# Altium schematic sheet 16 HDMI.SchDoc
size 420 x 297 mm; Address1: Address1; Address2: Address2; Address3: Address3; Address4: Address4; DocumentNumber: АБВГ.123456.001 Э3; SheetNumber: 16; SheetTotal: 23; Scale: 1:1; DocumentType: Схема электрическая принципиальная; FirstReferrence: АБВГ.123456.001
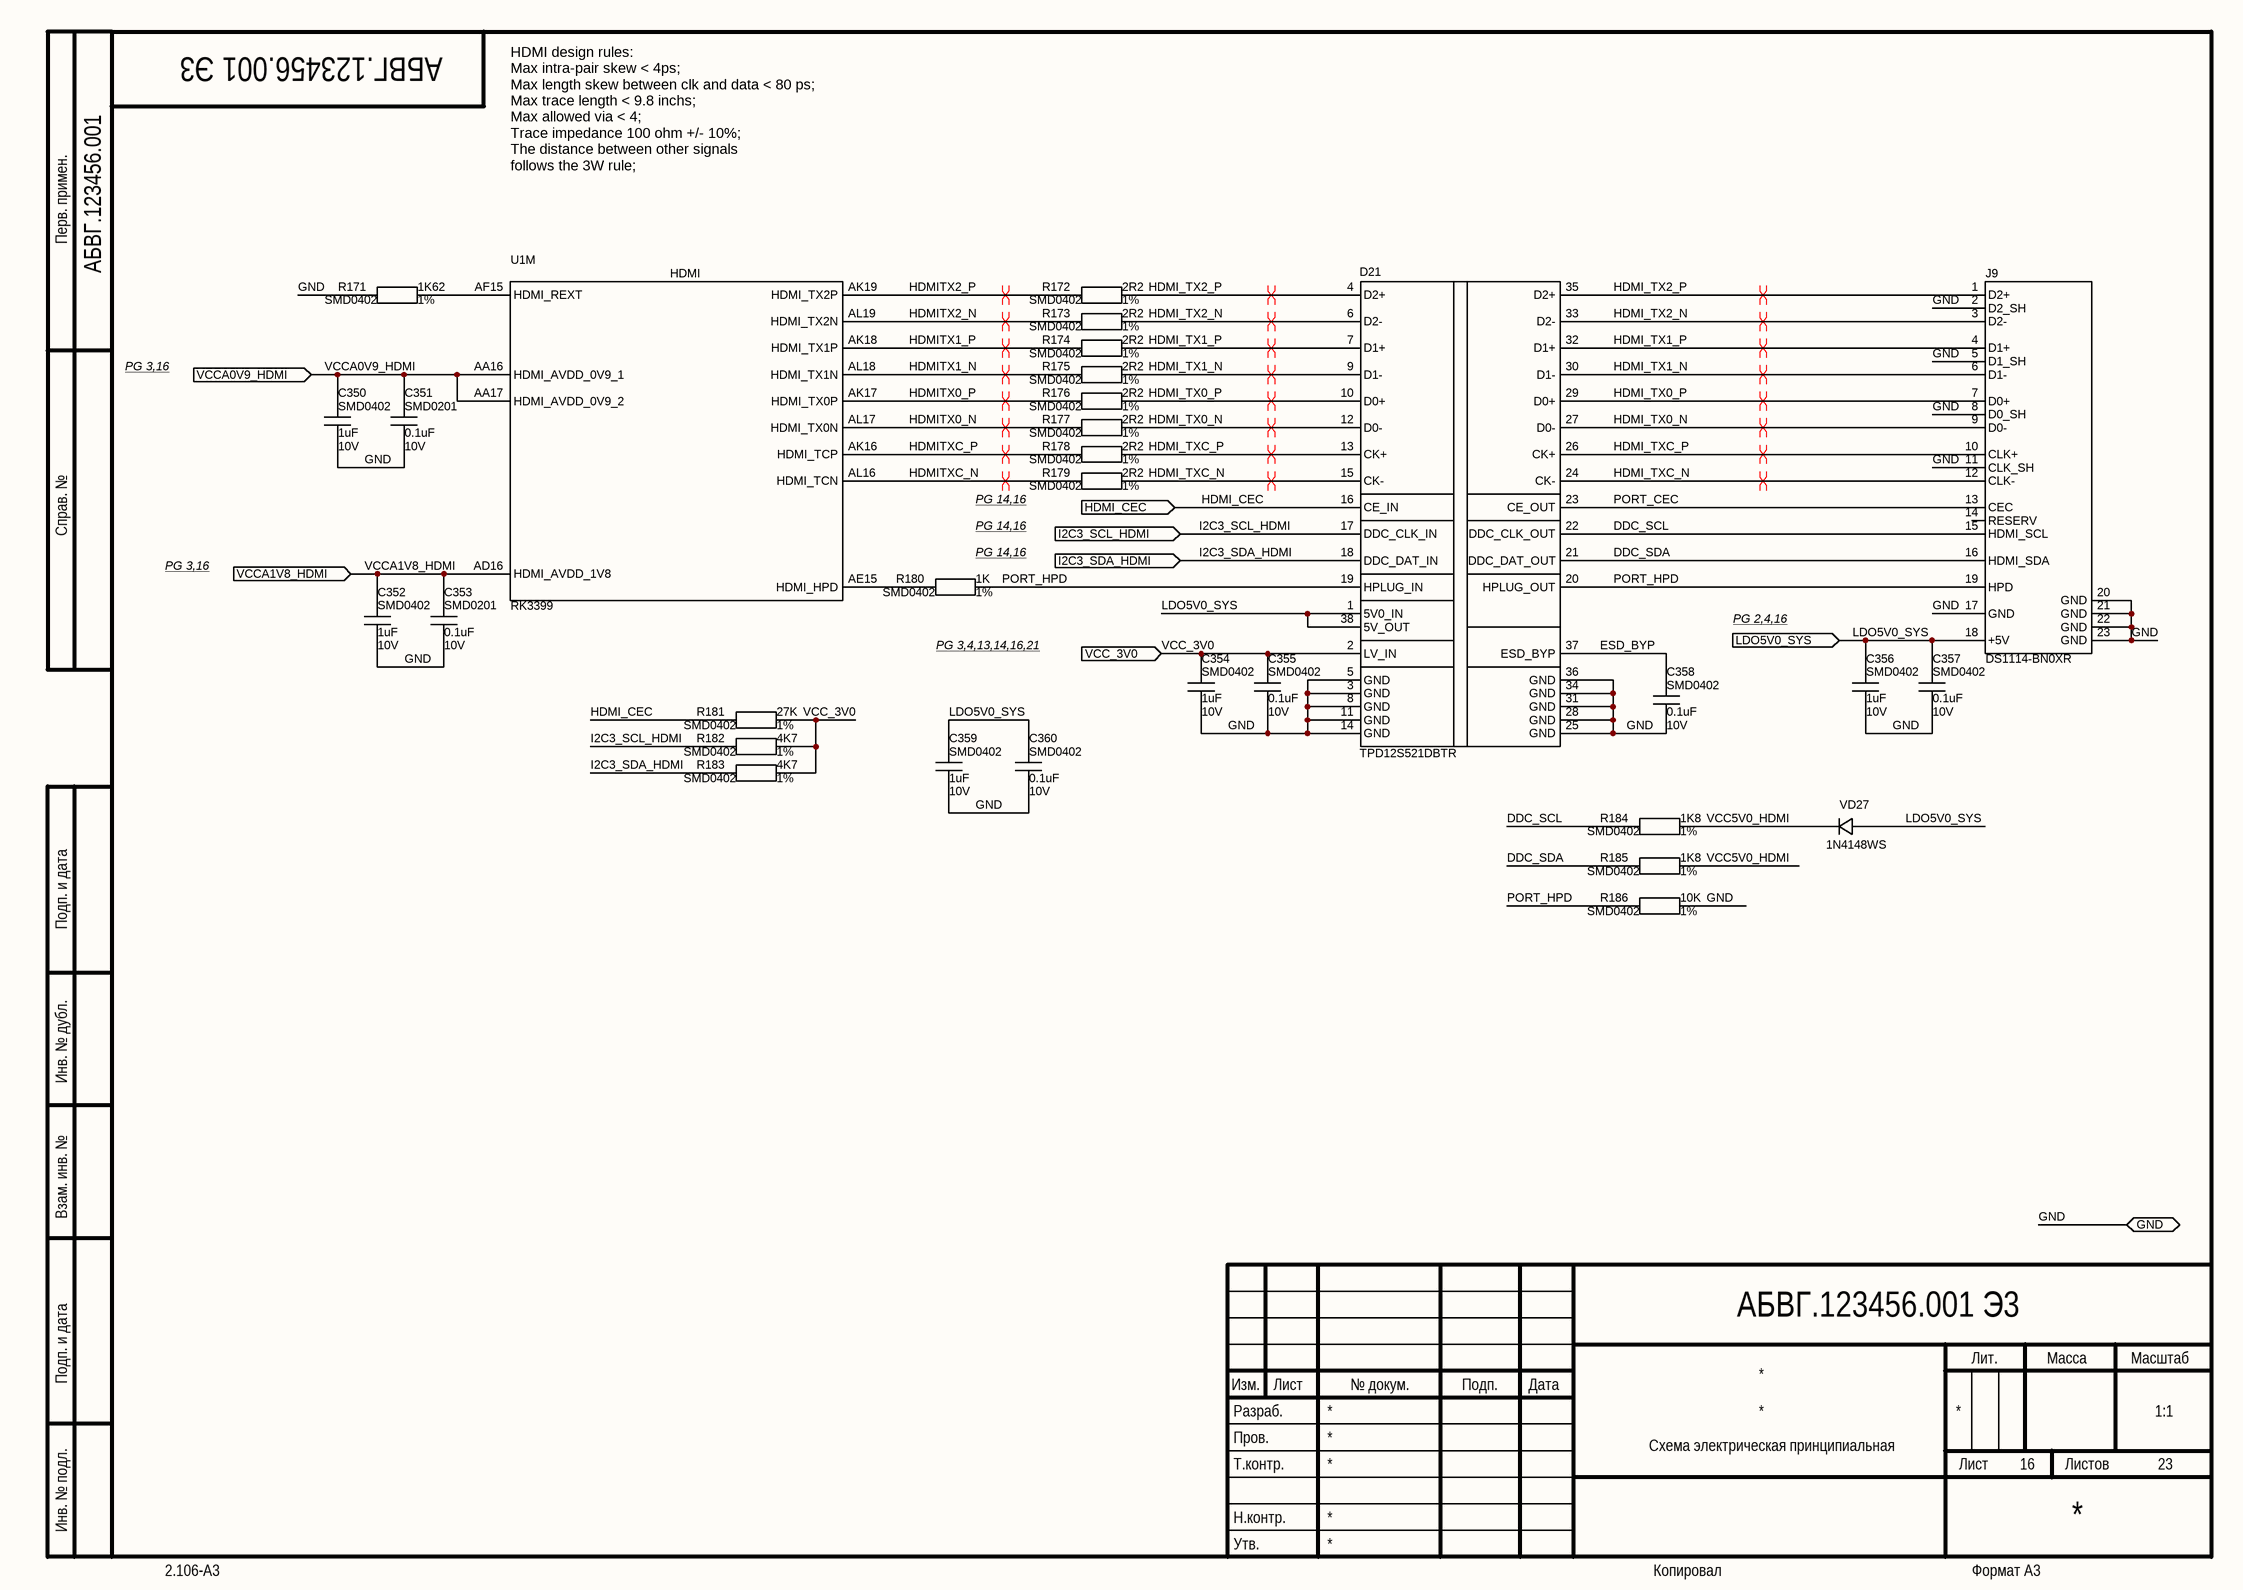
[diagram p0: 16 HDMI.SchDoc]

## Parts
C350  Package: SMD0402  Voltage: 10V  [CAP_SMD_0402]  (hidden comment: 1uF)
C351  Package: SMD0201  Voltage: 10V  [CAP_SMD_0201]  (hidden comment: 0.1uF)
C352  Package: SMD0402  Voltage: 10V  [CAP_SMD_0402_small]  (hidden comment: 1uF)
C353  Package: SMD0201  Voltage: 10V  [CAP_SMD_0201]  (hidden comment: 0.1uF)
C354  Package: SMD0402  Voltage: 10V  [CAP_SMD_0402]  (hidden comment: 1uF)
C355  Package: SMD0402  Voltage: 10V  [CAP_SMD_0402]  (hidden comment: 0.1uF)
C356  Package: SMD0402  Voltage: 10V  [CAP_SMD_0402]  (hidden comment: 1uF)
C357  Package: SMD0402  Voltage: 10V  [CAP_SMD_0402]  (hidden comment: 0.1uF)
C358  Package: SMD0402  Voltage: 10V  [CAP_SMD_0402]  (hidden comment: 0.1uF)
C359  Package: SMD0402  Voltage: 10V  [CAP_SMD_0402]  (hidden comment: 1uF)
C360  Package: SMD0402  Voltage: 10V  [CAP_SMD_0402]  (hidden comment: 0.1uF)
D21  TPD12S521DBTR  [TSSOP-38]
J9  DS1114-BN0XR  [DS1114-BN0XR]
R171  Package: SMD0402  Tolerance: 1%  [RES_SMD_0402_SMALL]  (hidden comment: 1K62)
R172  Package: SMD0402  Tolerance: 1%  [RES_SMD_0402]  (hidden comment: 2R2)
R173  Package: SMD0402  Tolerance: 1%  [RES_SMD_0402]  (hidden comment: 2R2)
R174  Package: SMD0402  Tolerance: 1%  [RES_SMD_0402]  (hidden comment: 2R2)
R175  Package: SMD0402  Tolerance: 1%  [RES_SMD_0402]  (hidden comment: 2R2)
R176  Package: SMD0402  Tolerance: 1%  [RES_SMD_0402]  (hidden comment: 2R2)
R177  Package: SMD0402  Tolerance: 1%  [RES_SMD_0402]  (hidden comment: 2R2)
R178  Package: SMD0402  Tolerance: 1%  [RES_SMD_0402]  (hidden comment: 2R2)
R179  Package: SMD0402  Tolerance: 1%  [RES_SMD_0402]  (hidden comment: 2R2)
R180  Package: SMD0402  Tolerance: 1%  [RES_SMD_0402]  (hidden comment: 1K)
R181  Package: SMD0402  Tolerance: 1%  [RES_SMD_0402]  (hidden comment: 27K)
R182  Package: SMD0402  Tolerance: 1%  [RES_SMD_0402]  (hidden comment: 4K7)
R183  Package: SMD0402  Tolerance: 1%  [RES_SMD_0402]  (hidden comment: 4K7)
R184  Package: SMD0402  Tolerance: 1%  [RES_SMD_0402]  (hidden comment: 1K8)
R185  Package: SMD0402  Tolerance: 1%  [RES_SMD_0402]  (hidden comment: 1K8)
R186  Package: SMD0402  Tolerance: 1%  [RES_SMD_0402]  (hidden comment: 10K)
U1  value RK3399  [BGA828C65P31X31_2100X2100X161N]  (hidden comment: RK3399_FF)  (part M of 23)
VD27  value 1N4148WS  [SOD323]  (hidden comment: Diode)

## Ports
GND (bidir), HDMI_CEC (in), I2C3_SCL_HDMI (in), I2C3_SDA_HDMI (in), LDO5V0_SYS (in), VCC_3V0 (in), VCCA0V9_HDMI (in), VCCA1V8_HDMI (in)

## Nets
DDC_SCL: D21.22(DDC_CLK_OUT) J9.15(HDMI_SCL) R184.1
DDC_SDA: D21.21(DDC_DAT_OUT) J9.16(HDMI_SDA) R185.1
ESD_BYP: C358.1 D21.37(ESD_BYP)
GND: C350.2 C351.2 C352.2 C353.2 C354.2 C355.2 C356.2 C357.2 C358.2 C359.2 C360.2 D21.3(GND) D21.5(GND) D21.8(GND) D21.11(GND) D21.14(GND) D21.25(GND) D21.28(GND) D21.31(GND) D21.34(GND) D21.36(GND) J9.2(D2_SH) J9.5(D1_SH) J9.8(D0_SH) J9.11(CLK_SH) J9.17(GND) J9.20(GND) J9.21(GND) J9.22(GND) J9.23(GND) R171.1 R186.1 ; port GND
HDMI_CEC: D21.16(CE_IN) R181.1 ; port HDMI_CEC
HDMI_TX0_N: D21.12(D0-) D21.27(D0-) J9.9(D0-) R177.2
HDMI_TX0_P: D21.10(D0+) D21.29(D0+) J9.7(D0+) R176.2
HDMI_TX1_N: D21.9(D1-) D21.30(D1-) J9.6(D1-) R175.2
HDMI_TX1_P: D21.7(D1+) D21.32(D1+) J9.4(D1+) R174.2
HDMI_TX2_N: D21.6(D2-) D21.33(D2-) J9.3(D2-) R173.2
HDMI_TX2_P: D21.4(D2+) D21.35(D2+) J9.1(D2+) R172.2
HDMI_TXC_N: D21.15(CK-) D21.24(CK-) J9.12(CLK-) R179.2
HDMI_TXC_P: D21.13(CK+) D21.26(CK+) J9.10(CLK+) R178.2
HDMITX0_N: R177.1 U1.AL17(HDMI_TX0N)
HDMITX0_P: R176.1 U1.AK17(HDMI_TX0P)
HDMITX1_N: R175.1 U1.AL18(HDMI_TX1N)
HDMITX1_P: R174.1 U1.AK18(HDMI_TX1P)
HDMITX2_N: R173.1 U1.AL19(HDMI_TX2N)
HDMITX2_P: R172.1 U1.AK19(HDMI_TX2P)
HDMITXC_N: R179.1 U1.AL16(HDMI_TCN)
HDMITXC_P: R178.1 U1.AK16(HDMI_TCP)
I2C3_SCL_HDMI: D21.17(DDC_CLK_IN) R182.1 ; port I2C3_SCL_HDMI
I2C3_SDA_HDMI: D21.18(DDC_DAT_IN) R183.1 ; port I2C3_SDA_HDMI
LDO5V0_SYS: C356.1 C357.1 C359.1 C360.1 D21.1(5V0_IN) D21.38(5V_OUT) J9.18(+5V) VD27.1(A) ; port LDO5V0_SYS
PORT_CEC: D21.23(CE_OUT) J9.13(CEC)
PORT_HPD: D21.19(HPLUG_IN) D21.20(HPLUG_OUT) J9.19(HPD) R180.2 R186.2
VCC5V0_HDMI: R184.2 R185.2 VD27.2(C)
VCC_3V0: C354.1 C355.1 D21.2(LV_IN) R181.2 R182.2 R183.2 ; port VCC_3V0
VCCA0V9_HDMI: C350.1 C351.1 U1.AA16(HDMI_AVDD_0V9_1) U1.AA17(HDMI_AVDD_0V9_2) ; port VCCA0V9_HDMI
VCCA1V8_HDMI: C352.1 C353.1 U1.AD16(HDMI_AVDD_1V8) ; port VCCA1V8_HDMI
NetR171_2: R171.2 U1.AF15(HDMI_REXT)
NetR180_1: R180.1 U1.AE15(HDMI_HPD)

Not connected (* = marked no-connect by the designer): J9 14(RESERV)

## Layout directives
differential pair; differential pair class DiffPair_1; net class DiffPair_1: HDMI_TX0_N, HDMI_TX0_P, HDMI_TX1_N, HDMI_TX1_P, HDMI_TX2_N, HDMI_TX2_P, HDMI_TXC_N, HDMI_TXC_P, HDMITX0_N, HDMITX0_P, HDMITX1_N, HDMITX1_P, HDMITX2_N, HDMITX2_P, HDMITXC_N, HDMITXC_P

## Notes on the sheet
- HDMI design rules:
  Max intra-pair skew < 4ps;
  Max length skew between clk and data < 80 ps;
  Max trace length < 9.8 inchs;
  Max allowed via < 4;
  Trace impedance 100 ohm +/- 10%;
  The distance between other signals
  follows the 3W rule;
- Перв. примен.
- PG 3,16
- Справ. №
- PG 14,16
- (near R180) PG 14,16
- (near R180) PG 3,4,13,14,16,21
- PG 2,4,16
- Подп. и дата
- Инв. № дубл.
- Взам. инв. №
- Разраб.
- Изм.
- Лист
- № докум.
- Подп.
- Дата
- Лит.
- Масса
- Масштаб
- Пров.
- Т.контр.
- Листов
- Инв. № подл.
- Утв.
- Н.контр.
- 2.106-A3
- Копировал
- Формат А3
- (in symbol RK3399_FF, part M) HDMI

## Library data of the parts
C350 C352 C354 C356 C359 = Ceramic_Cap: PartNumber: CC0402KRX5R6BB105; ComponentType: SMD Ceramic Chip Capacitor; Manufacter: *; Tolerance: *; Value: 1uF
  C350 C354 C356 C359: ClassName: *
  C352: ClassName: Solder_Clearence
C351 C353 = Ceramic_Cap: PartNumber: CC0201KRX5R6BB104; ComponentType: SMD Ceramic Chip Capacitor; Manufacter: *; Tolerance: *; ClassName: *; Value: 0.1uF
C355 C357 C358 C360 = Ceramic_Cap: PartNumber: CC0402KRX5R6BB104; ComponentType: SMD Ceramic Chip Capacitor; Manufacter: *; Tolerance: *; ClassName: *; Value: 0.1uF
J9 = HDMI_A_1: ComponentType: *; Manufacter: *; Package: DS1114-BN0XR; PartNumber: DS1114-BN0XR; ClassName: *; Value: DS1114-BN0XR
R171 = Chip_Res: PartNumber: RC0402FR-071K62L; ComponentType: SMD Chip Resistor; Manufacter: *; Voltage: *; ClassName: Solder_Clearence; Value: 1K62
R172-R179 = Chip_Res: PartNumber: RC0402FR-072R2L; ComponentType: SMD Chip Resistor; Manufacter: *; Voltage: *; ClassName: *; Value: 2R2
R180 = Chip_Res: PartNumber: RC0402FR-071KL; ComponentType: SMD Chip Resistor; Manufacter: *; Voltage: *; ClassName: *; Value: 1K
R181 = Chip_Res: PartNumber: RC0402FR-0727KL; ComponentType: SMD Chip Resistor; Manufacter: *; Voltage: *; ClassName: *; Value: 27K
R182 R183 = Chip_Res: PartNumber: RC0402FR-074K7L; ComponentType: SMD Chip Resistor; Manufacter: *; Voltage: *; ClassName: *; Value: 4K7
R184 R185 = Chip_Res: PartNumber: RC0402FR-071K8L; ComponentType: SMD Chip Resistor; Manufacter: *; Voltage: *; ClassName: *; Value: 1K8
R186 = Chip_Res: PartNumber: RC0402FR-0710KL; ComponentType: SMD Chip Resistor; Manufacter: *; Voltage: *; ClassName: *; Value: 10K
D21 = TPD12S521DBTR: ComponentType: *; Manufacter: *; Package: TSSOP-38; PartNumber: TPD12S521DBTR; ClassName: *; Value: TPD12S521DBTR
U1 = RK3399_FF: Package: BGA828; ComponentType: *; Manufacter: *; PartNumber: RK3399; ClassName: *
VD27 = Diode: ComponentType: *; Manufacter: *; Package: SOD323; PartNumber: 1N4148WS; ClassName: *